# EAGLE design Pasqually_Pi_Hat (EAGLE 9.6.2)
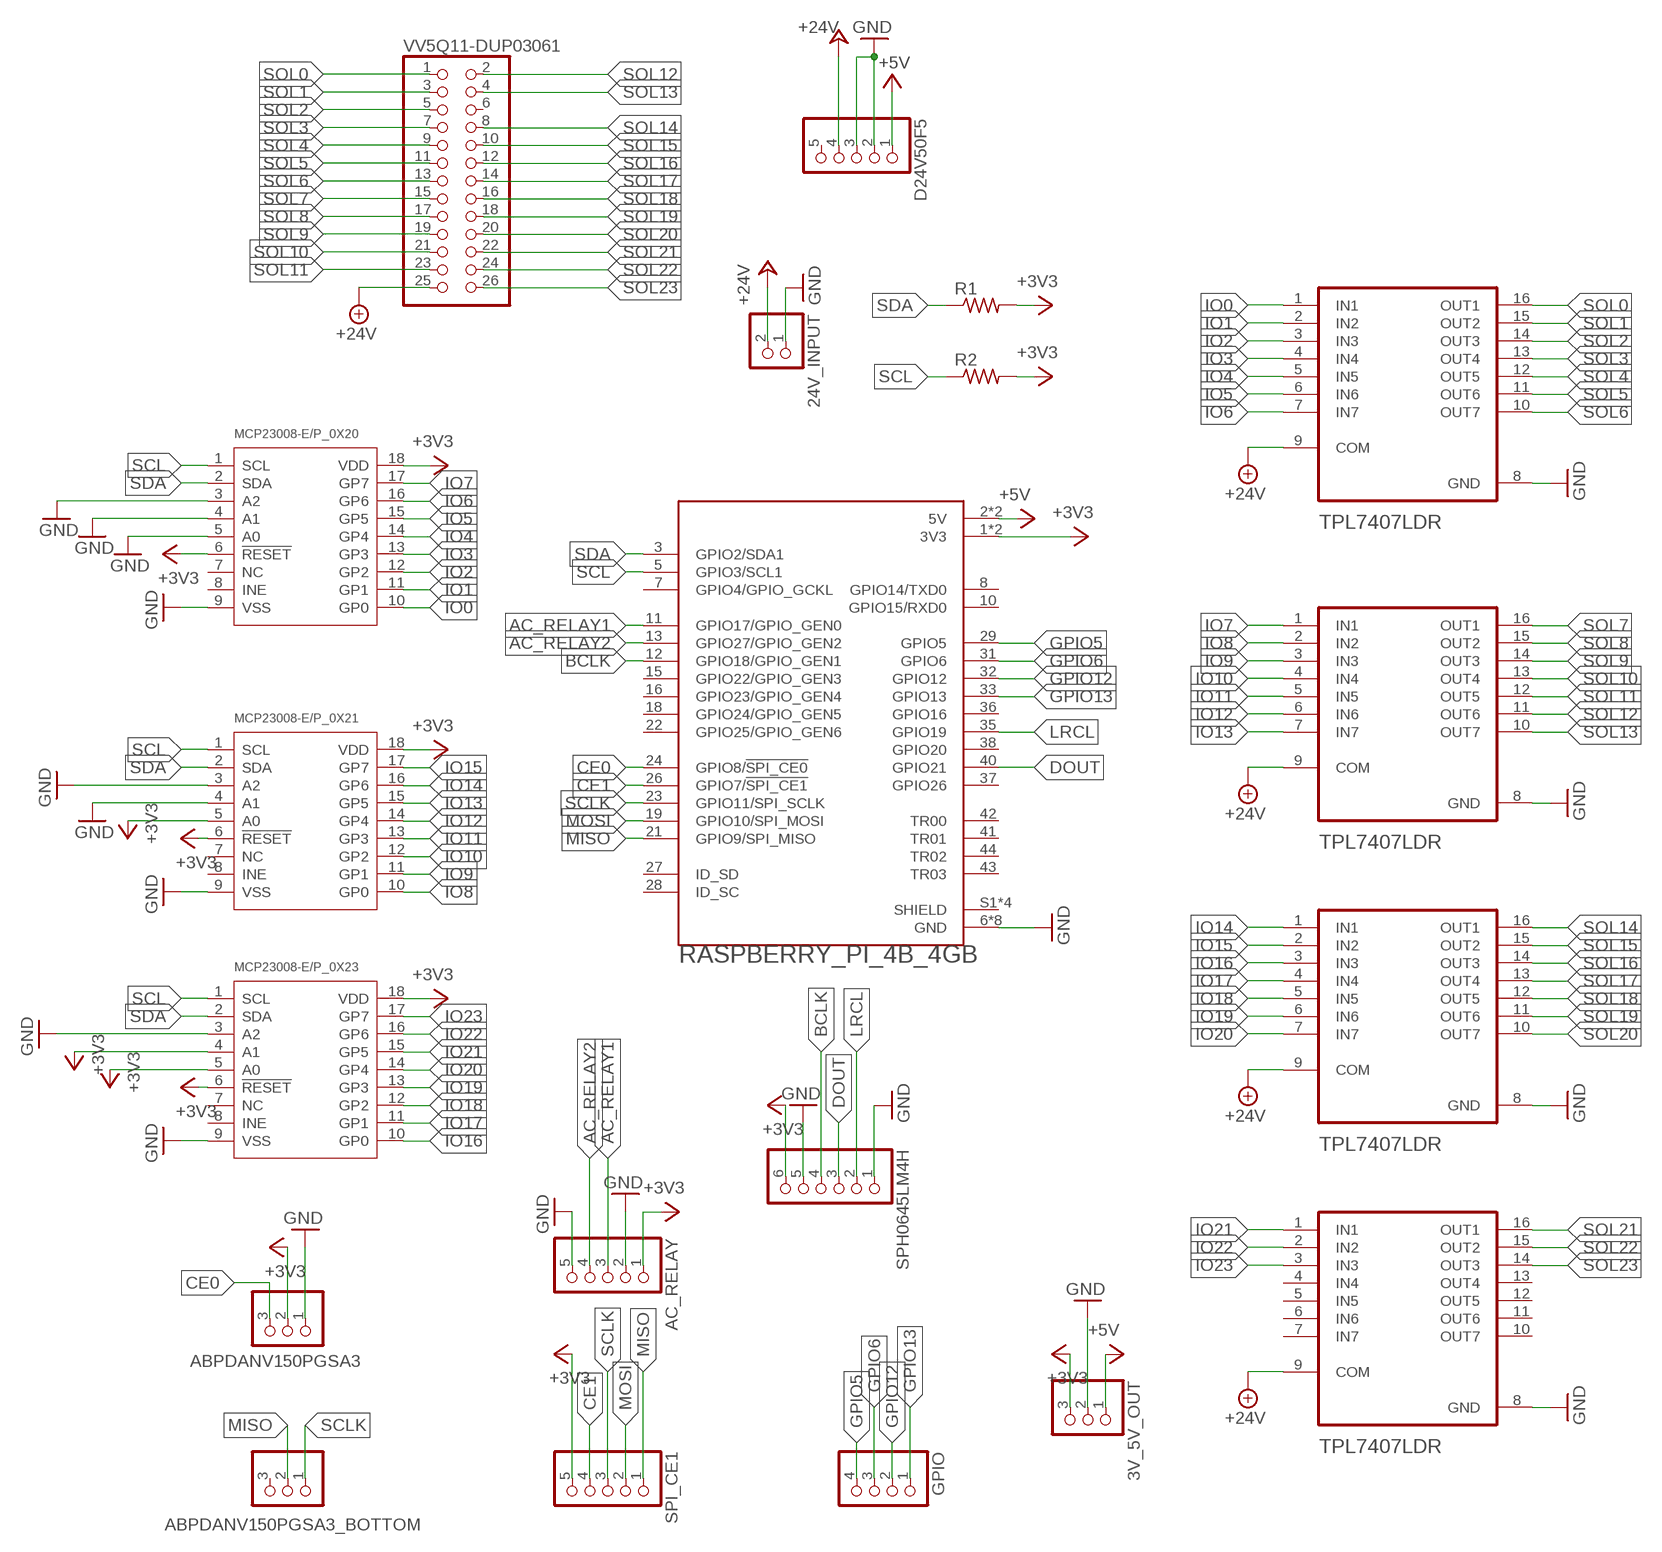
[diagram p0: schematic, sheet 1]

## Parts
3V_5V_OUT  PINHD-1X3  [1X03]
24V_INPUT  PINHD-1X2  [1X02]
ABPDANV150PGSA3  PINHD-1X3  [1X03]
ABPDANV150PGSA3_BOTTOM  PINHD-1X3  [1X03]
AC_RELAY  PINHD-1X5  [1X05]
D24V50F5  PINHD-1X5  [1X05]
GPIO  PINHD-1X4  [1X04]
MCP23008-E/P_0X20  INTERFACE-MCP23008-E/P(DIP18-7.62MM)  [DIP18-2.54-22.8X7.62MM]
MCP23008-E/P_0X21  INTERFACE-MCP23008-E/P(DIP18-7.62MM)  [DIP18-2.54-22.8X7.62MM]
MCP23008-E/P_0X23  INTERFACE-MCP23008-E/P(DIP18-7.62MM)  [DIP18-2.54-22.8X7.62MM]
R1  R-US_0309/10  [0309/10]
R2  R-US_0309/10  [0309/10]
SPH0645LM4H  PINHD-1X6  [1X06]
SPI_CE1  PINHD-1X5  [1X05]
U0  TPL7407LDR  [SOIC127P600X175-16N]
U1  TPL7407LDR  [SOIC127P600X175-16N]
U2  TPL7407LDR  [SOIC127P600X175-16N]
U3  TPL7407LDR  [SOIC127P600X175-16N]
U4  RASPBERRY_PI_4B_4GB  [MODULE_RASPBERRY_PI_4B_4GB]
VV5Q11-DUP03061  PINHD-2X13  [2X13]

## Nets
+3V3: 3V_5V_OUT.3 ABPDANV150PGSA3.2 AC_RELAY.1 MCP23008-E/P_0X20.6(!RESET) MCP23008-E/P_0X20.18(VDD) MCP23008-E/P_0X21.5(A0) MCP23008-E/P_0X21.6(!RESET) MCP23008-E/P_0X21.18(VDD) MCP23008-E/P_0X23.4(A1) MCP23008-E/P_0X23.5(A0) MCP23008-E/P_0X23.6(!RESET) MCP23008-E/P_0X23.18(VDD) R1.2 R2.2 SPH0645LM4H.6 SPI_CE1.5 U4.1(3V3) U4.17(3V3)
+5V: 3V_5V_OUT.1 D24V50F5.1 U4.2(5V) U4.4(5V)
+24V: 24V_INPUT.2 D24V50F5.4 U0.9(COM) U1.9(COM) U2.9(COM) U3.9(COM) VV5Q11-DUP03061.25
AC_RELAY1: AC_RELAY.3 U4.11(GPIO17/GPIO_GEN0)
AC_RELAY2: AC_RELAY.4 U4.13(GPIO27/GPIO_GEN2)
BCLK: SPH0645LM4H.4 U4.12(GPIO18/GPIO_GEN1)
CE0: ABPDANV150PGSA3.3 U4.24(GPIO8/!SPI_CE0!)
CE1: SPI_CE1.4 U4.26(GPIO7/!SPI_CE1!)
DOUT: SPH0645LM4H.3 U4.40(GPIO21)
GND: 3V_5V_OUT.2 24V_INPUT.1 ABPDANV150PGSA3.1 AC_RELAY.2 AC_RELAY.5 D24V50F5.2 D24V50F5.3 MCP23008-E/P_0X20.3(A2) MCP23008-E/P_0X20.4(A1) MCP23008-E/P_0X20.5(A0) MCP23008-E/P_0X20.9(VSS) MCP23008-E/P_0X21.3(A2) MCP23008-E/P_0X21.4(A1) MCP23008-E/P_0X21.9(VSS) MCP23008-E/P_0X23.3(A2) MCP23008-E/P_0X23.9(VSS) SPH0645LM4H.1 SPH0645LM4H.5 U0.8(GND) U1.8(GND) U2.8(GND) U3.8(GND) U4.6(GND) U4.9(GND) U4.14(GND) U4.20(GND) U4.25(GND) U4.30(GND) U4.34(GND) U4.39(GND)
GPIO5: GPIO.4 U4.29(GPIO5)
GPIO6: GPIO.3 U4.31(GPIO6)
GPIO12: GPIO.2 U4.32(GPIO12)
GPIO13: GPIO.1 U4.33(GPIO13)
IO0: MCP23008-E/P_0X20.10(GP0) U0.1(IN1)
IO1: MCP23008-E/P_0X20.11(GP1) U0.2(IN2)
IO2: MCP23008-E/P_0X20.12(GP2) U0.3(IN3)
IO3: MCP23008-E/P_0X20.13(GP3) U0.4(IN4)
IO4: MCP23008-E/P_0X20.14(GP4) U0.5(IN5)
IO5: MCP23008-E/P_0X20.15(GP5) U0.6(IN6)
IO6: MCP23008-E/P_0X20.16(GP6) U0.7(IN7)
IO7: MCP23008-E/P_0X20.17(GP7) U1.1(IN1)
IO8: MCP23008-E/P_0X21.10(GP0) U1.2(IN2)
IO9: MCP23008-E/P_0X21.11(GP1) U1.3(IN3)
IO10: MCP23008-E/P_0X21.12(GP2) U1.4(IN4)
IO11: MCP23008-E/P_0X21.13(GP3) U1.5(IN5)
IO12: MCP23008-E/P_0X21.14(GP4) U1.6(IN6)
IO13: MCP23008-E/P_0X21.15(GP5) U1.7(IN7)
IO14: MCP23008-E/P_0X21.16(GP6) U2.1(IN1)
IO15: MCP23008-E/P_0X21.17(GP7) U2.2(IN2)
IO16: MCP23008-E/P_0X23.10(GP0) U2.3(IN3)
IO17: MCP23008-E/P_0X23.11(GP1) U2.4(IN4)
IO18: MCP23008-E/P_0X23.12(GP2) U2.5(IN5)
IO19: MCP23008-E/P_0X23.13(GP3) U2.6(IN6)
IO20: MCP23008-E/P_0X23.14(GP4) U2.7(IN7)
IO21: MCP23008-E/P_0X23.15(GP5) U3.1(IN1)
IO22: MCP23008-E/P_0X23.16(GP6) U3.2(IN2)
IO23: MCP23008-E/P_0X23.17(GP7) U3.3(IN3)
LRCL: SPH0645LM4H.2 U4.35(GPIO19)
MISO: ABPDANV150PGSA3_BOTTOM.2 SPI_CE1.1 U4.21(GPIO9/SPI_MISO)
MOSI: SPI_CE1.2 U4.19(GPIO10/SPI_MOSI)
SCL: MCP23008-E/P_0X20.1(SCL) MCP23008-E/P_0X21.1(SCL) MCP23008-E/P_0X23.1(SCL) R2.1 U4.5(GPIO3/SCL1)
SCLK: ABPDANV150PGSA3_BOTTOM.1 SPI_CE1.3 U4.23(GPIO11/SPI_SCLK)
SDA: MCP23008-E/P_0X20.2(SDA) MCP23008-E/P_0X21.2(SDA) MCP23008-E/P_0X23.2(SDA) R1.1 U4.3(GPIO2/SDA1)
SOL0: U0.16(OUT1) VV5Q11-DUP03061.1
SOL1: U0.15(OUT2) VV5Q11-DUP03061.3
SOL2: U0.14(OUT3) VV5Q11-DUP03061.5
SOL3: U0.13(OUT4) VV5Q11-DUP03061.7
SOL4: U0.12(OUT5) VV5Q11-DUP03061.9
SOL5: U0.11(OUT6) VV5Q11-DUP03061.11
SOL6: U0.10(OUT7) VV5Q11-DUP03061.13
SOL7: U1.16(OUT1) VV5Q11-DUP03061.15
SOL8: U1.15(OUT2) VV5Q11-DUP03061.17
SOL9: U1.14(OUT3) VV5Q11-DUP03061.19
SOL10: U1.13(OUT4) VV5Q11-DUP03061.21
SOL11: U1.12(OUT5) VV5Q11-DUP03061.23
SOL12: U1.11(OUT6) VV5Q11-DUP03061.2
SOL13: U1.10(OUT7) VV5Q11-DUP03061.4
SOL14: U2.16(OUT1) VV5Q11-DUP03061.8
SOL15: U2.15(OUT2) VV5Q11-DUP03061.10
SOL16: U2.14(OUT3) VV5Q11-DUP03061.12
SOL17: U2.13(OUT4) VV5Q11-DUP03061.14
SOL18: U2.12(OUT5) VV5Q11-DUP03061.16
SOL19: U2.11(OUT6) VV5Q11-DUP03061.18
SOL20: U2.10(OUT7) VV5Q11-DUP03061.20
SOL21: U3.16(OUT1) VV5Q11-DUP03061.22
SOL22: U3.15(OUT2) VV5Q11-DUP03061.24
SOL23: U3.14(OUT3) VV5Q11-DUP03061.26
Unconnected: ABPDANV150PGSA3_BOTTOM.3 D24V50F5.5 MCP23008-E/P_0X20.7(NC) MCP23008-E/P_0X20.8(INE) MCP23008-E/P_0X21.7(NC) MCP23008-E/P_0X21.8(INE) MCP23008-E/P_0X23.7(NC) MCP23008-E/P_0X23.8(INE) U3.4(IN4) U3.5(IN5) U3.6(IN6) U3.7(IN7) U3.10(OUT7) U3.11(OUT6) U3.12(OUT5) U3.13(OUT4) U4.7(GPIO4/GPIO_GCKL) U4.8(GPIO14/TXD0) U4.10(GPIO15/RXD0) U4.15(GPIO22/GPIO_GEN3) U4.16(GPIO23/GPIO_GEN4) U4.18(GPIO24/GPIO_GEN5) U4.22(GPIO25/GPIO_GEN6) U4.27(ID_SD) U4.28(ID_SC) U4.36(GPIO16) U4.37(GPIO26) U4.38(GPIO20) U4.41(TR01) U4.42(TR00) U4.43(TR03) U4.44(TR02) VV5Q11-DUP03061.6

## Power pins joined to a net without a drawn wire
SHIELD: U4.S1(SHIELD) U4.S2(SHIELD) U4.S3(SHIELD) U4.S4(SHIELD)

## Library data of the parts
3V_5V_OUT ABPDANV150PGSA3 ABPDANV150PGSA3_BOTTOM = pinhead:PINHD-1X3: PIN HEADER
24V_INPUT = pinhead:PINHD-1X2: PIN HEADER
AC_RELAY D24V50F5 SPI_CE1 = pinhead:PINHD-1X5: PIN HEADER
GPIO = pinhead:PINHD-1X4: PIN HEADER
MCP23008-E/P_0X20 MCP23008-E/P_0X21 MCP23008-E/P_0X23 = INTERFACE-MCP23008-E_P_DIP18-7.62MM_:INTERFACE-MCP23008-E/P(DIP18-7.62MM): 310070051 Check availability <https://pricing.snapeda.com/parts/MCP23008-E/P/Microchip/view-part?ref=eda>; AVAILABILITY: In Stock; CHECK_PRICES: https://www.snapeda.com/parts/MCP23008-E/P/Microchip/view-part/?ref=eda; DESCRIPTION: 8-BIT INPUT/OUTPUT EXPANDER, I2C INTERFACE | Microchip Technology Inc. MCP23008-E/P; MF: Microchip; MP: MCP23008-E/P; PACKAGE: PDIP-18 Microchip; PRICE: None; SNAPEDA_LINK: https://www.snapeda.com/parts/MCP23008-E/P/Microchip/view-part/?ref=snap
R1 R2 = rcl:R-US_: RESISTOR, American symbol; SPICEPREFIX: R
SPH0645LM4H = pinhead:PINHD-1X6: PIN HEADER
U0 U1-U3 = TPL7407LDR:TPL7407LDR: Check availability <https://pricing.snapeda.com/parts/TPL7407LDR/Texas%20Instruments/view-part?ref=eda>; AVAILABILITY: In Stock; CHECK_PRICES: https://www.snapeda.com/parts/TPL7407LDR/Texas+Instruments/view-part/?ref=eda; DESCRIPTION: 40-V, 7-ch NMOS array low-side driver; MF: Texas Instruments; MP: TPL7407LDR; PACKAGE: SOIC-16 Texas Instruments; PRICE: None; PURCHASE-URL: https://www.snapeda.com/api/url_track_click_mouser/?unipart_id=48350&manufacturer=Texas Instruments&part_name=TPL7407LDR&search_term=None; SNAPEDA_LINK: https://www.snapeda.com/parts/TPL7407LDR/Texas+Instruments/view-part/?ref=snap
U4 = RASPBERRY_PI_4B_4GB:RASPBERRY_PI_4B_4GB: Check availability <https://pricing.snapeda.com/parts/RASPBERRY%20PI%204B/4GB/Raspberry%20Pi/view-part?ref=eda>; AVAILABILITY: In Stock; CHECK_PRICES: https://www.snapeda.com/parts/RASPBERRY%20PI%204B/4GB/Raspberry+Pi/view-part/?ref=eda; DESCRIPTION: BCM2711 Raspberry Pi 4 Model B 4GB - ARM® Cortex®-A72 MPU Embedded Evaluation Board; MF: Raspberry Pi; MP: RASPBERRY PI 4B/4GB; PACKAGE: None; PRICE: None; SNAPEDA_LINK: https://www.snapeda.com/parts/RASPBERRY%20PI%204B/4GB/Raspberry+Pi/view-part/?ref=snap
VV5Q11-DUP03061 = pinhead:PINHD-2X13: PIN HEADER

## Board
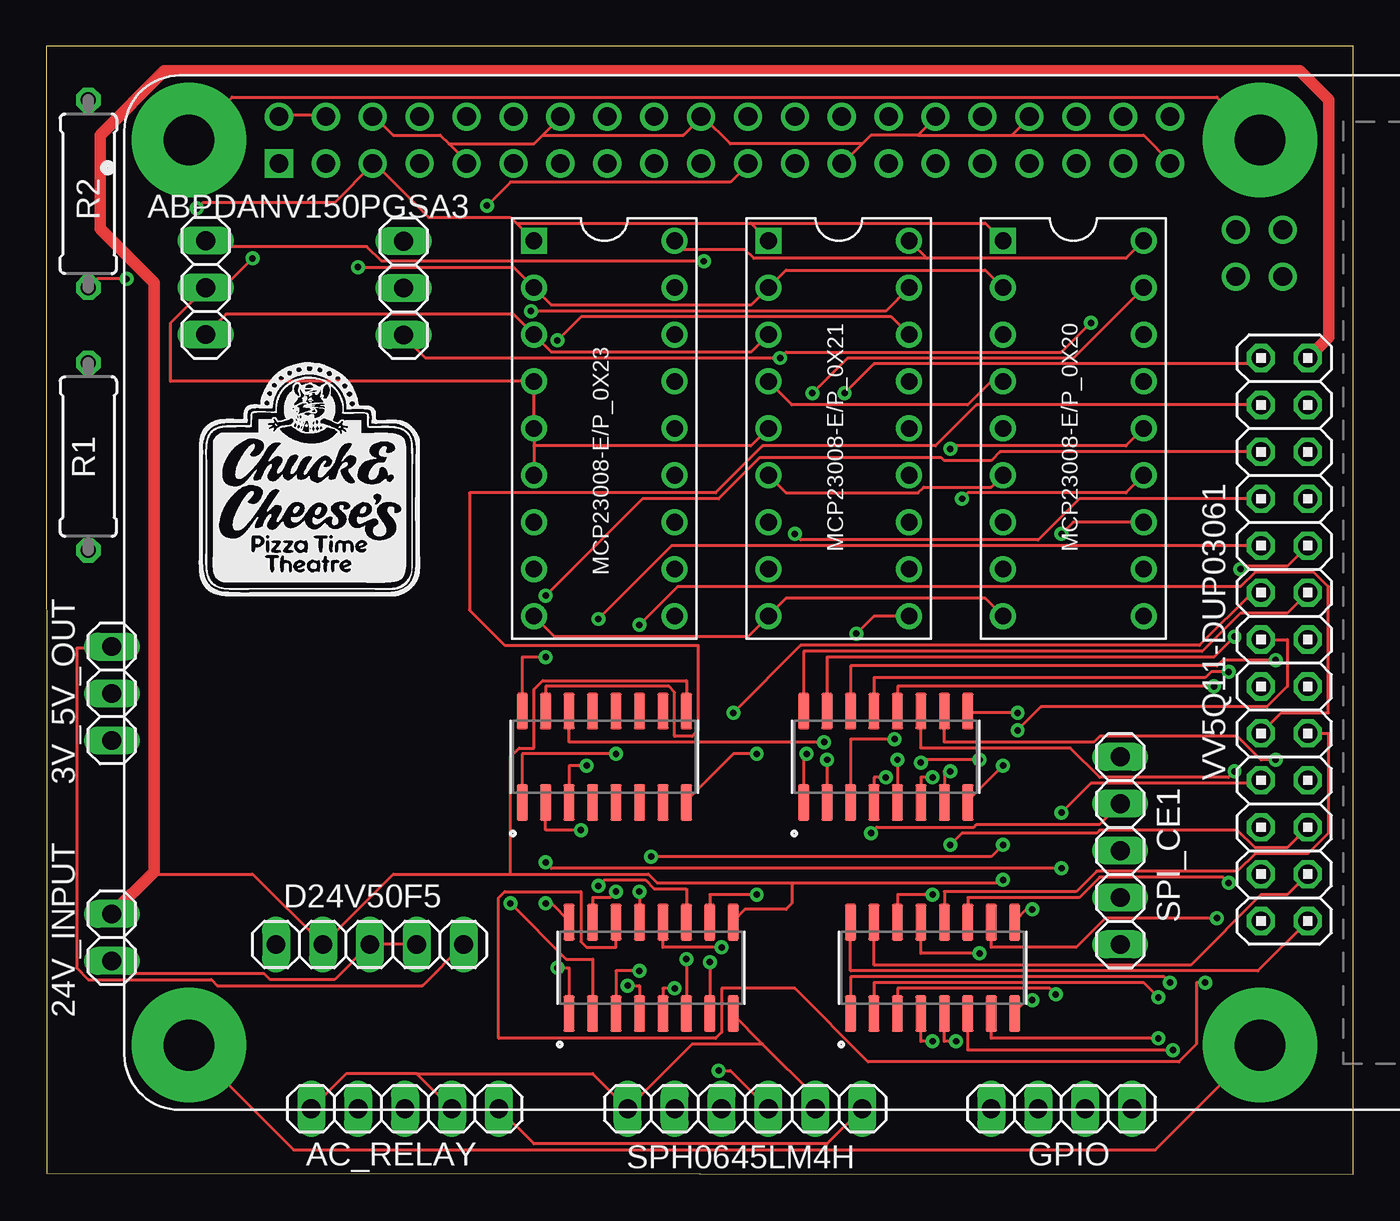
[diagram p1: board, top side]
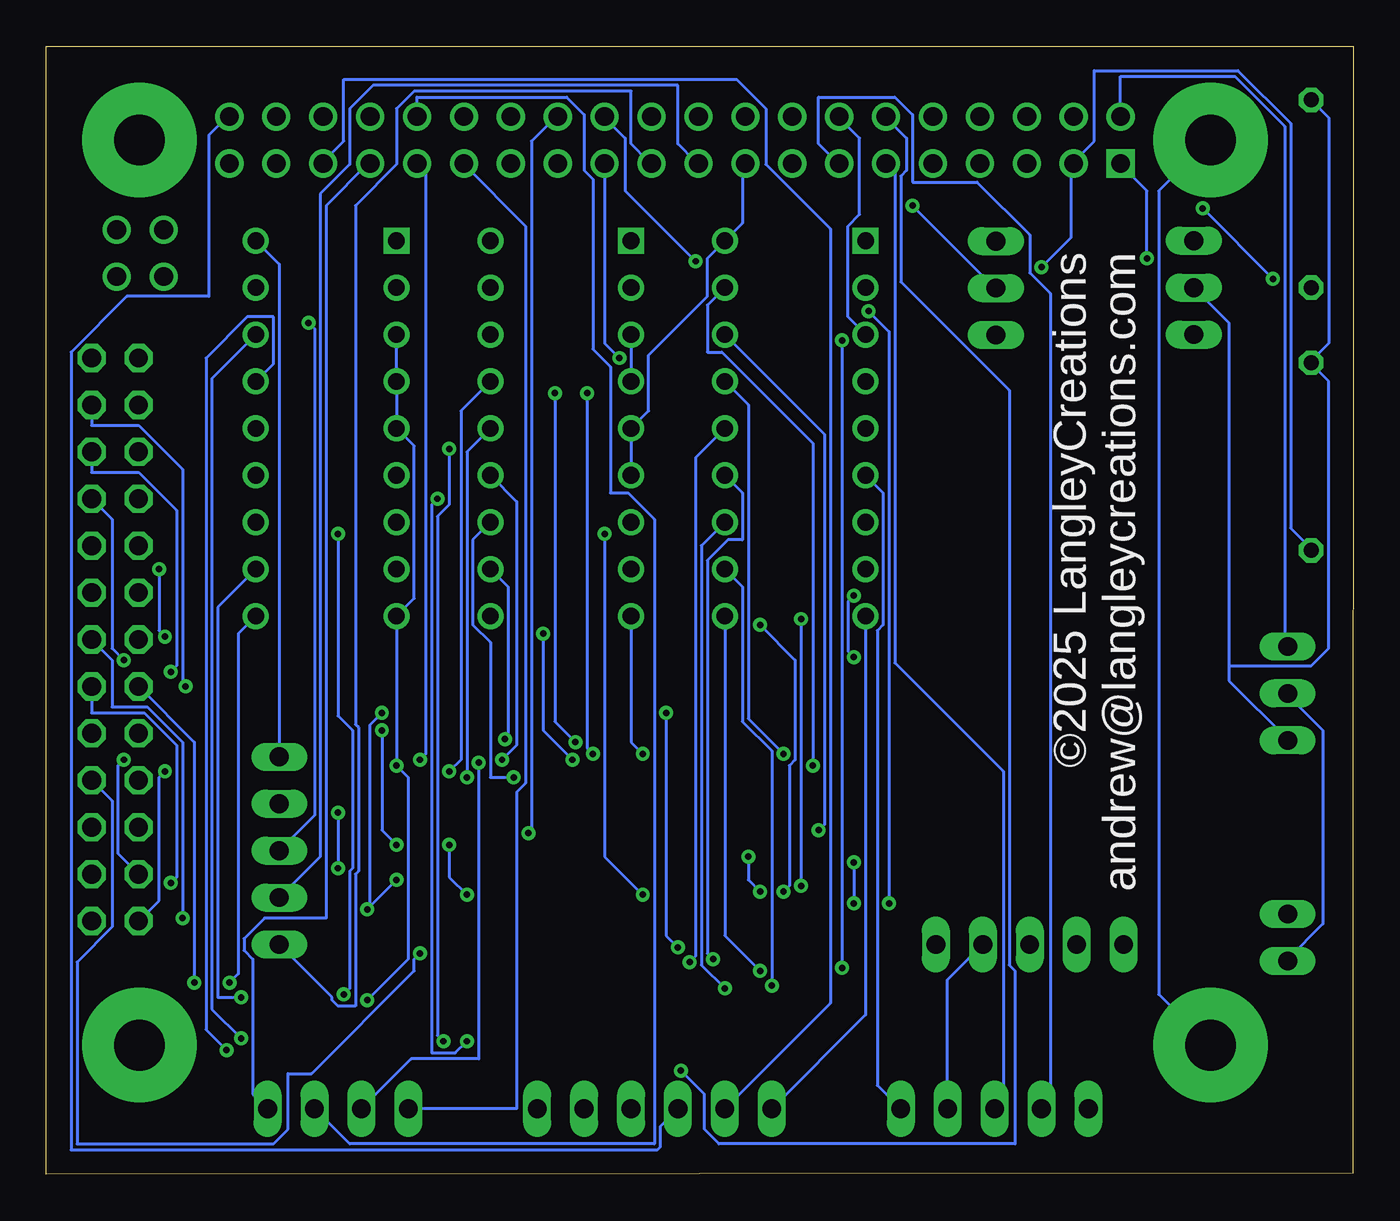
[diagram p2: board, bottom side, seen from below]

Size 70.79 x 61.08 mm. Coordinates in mm from the lower left corner, seen from the top.
Outline: 0.04,0.06 70.79,0 70.79,61.08 0,61.08 0.04,0.06
Copper layers (1*16): Top 0.035mm / dielectric 1.5mm / Bottom 0.035mm
Design rules "default": minimum track width 6mil, minimum drill 0.35mm, track to track 6mil, track to pad 6mil, pad to pad 6mil, via to via 6mil, smd to smd 6mil, copper to edge 40mil, drill to drill 6mil, minimum pad ring 10mil, minimum via ring 8mil, stop-mask expansion 4mil, vias tented up to drill 0mil, thermal gap 10mil

### Footprints (pad centres in the part's own frame; a part is rotated, then mirrored left to right if it is on the bottom)
1X03 = drill 1.016 long: 1 -2.54,0; 2 0,0; 3 2.54,0
1X02 = drill 1.016 long: 1 -1.27,0; 2 1.27,0
1X05 = drill 1.016 long: 1 -5.08,0; 2 -2.54,0; 3 0,0; 4 2.54,0; 5 5.08,0
1X04 = drill 1.016 long: 1 -3.81,0; 2 -1.27,0; 3 1.27,0; 4 3.81,0
DIP18-2.54-22.8X7.62MM = drill 0.9 pad 1.4 square: 1 -10.16,-3.81 | drill 0.9 pad 1.4: 2 -7.62,-3.81; 3 -5.08,-3.81; 4 -2.54,-3.81; 5 0,-3.81; 6 2.54,-3.81; 7 5.08,-3.81; 8 7.62,-3.81; 9 10.16,-3.81; 10 10.16,3.81; 11 7.62,3.81; 12 5.08,3.81; 13 2.54,3.81; 14 0,3.81; 15 -2.54,3.81; 16 -5.08,3.81; 17 -7.62,3.81; 18 -10.16,3.81
0309/10 = drill 0.813 octagon: 1 -5.08,0; 2 5.08,0
1X06 = drill 1.016 long: 1 -6.35,0; 2 -3.81,0; 3 -1.27,0; 4 1.27,0; 5 3.81,0; 6 6.35,0
SOIC127P600X175-16N = smd 1.97 x 0.6: 1 -2.475,4.445; 2 -2.475,3.175; 3 -2.475,1.905; 4 -2.475,0.635; 5 -2.475,-0.635; 6 -2.475,-1.905; 7 -2.475,-3.175; 8 -2.475,-4.445; 9 2.475,-4.445; 10 2.475,-3.175; 11 2.475,-1.905; 12 2.475,-0.635; 13 2.475,0.635; 14 2.475,1.905; 15 2.475,3.175; 16 2.475,4.445
MODULE_RASPBERRY_PI_4B_4GB = drill 1.016 square: 1 -34.13,23.23 | drill 1.016: 2 -34.13,25.77; 3 -31.59,23.23; 4 -31.59,25.77; 5 -29.05,23.23; 6 -29.05,25.77; 7 -26.51,23.23; 8 -26.51,25.77; 9 -23.97,23.23; 10 -23.97,25.77; 11 -21.43,23.23; 12 -21.43,25.77; 13 -18.89,23.23; 14 -18.89,25.77; 15 -16.35,23.23; 16 -16.35,25.77; 17 -13.81,23.23; 18 -13.81,25.77; 19 -11.27,23.23; 20 -11.27,25.77; 21 -8.73,23.23; 22 -8.73,25.77; 23 -6.19,23.23; 24 -6.19,25.77; 25 -3.65,23.23; 26 -3.65,25.77; 27 -1.11,23.23; 28 -1.11,25.77; 29 1.43,23.23; 30 1.43,25.77; 31 3.97,23.23; 32 3.97,25.77; 33 6.51,23.23; 34 6.51,25.77; 35 9.05,23.23; 36 9.05,25.77; 37 11.59,23.23; 38 11.59,25.77; 39 14.13,23.23; 40 14.13,25.77; 41 20.23,17.107; 42 20.23,19.647; 43 17.69,17.107; 44 17.69,19.647 | drill 2.75 pad 6.2: S1 -39,24.5; S2 19,24.5; S3 19,-24.5; S4 -39,-24.5
2X13 = drill 1.016 octagon: 1 -15.24,-1.27; 2 -15.24,1.27; 3 -12.7,-1.27; 4 -12.7,1.27; 5 -10.16,-1.27; 6 -10.16,1.27; 7 -7.62,-1.27; 8 -7.62,1.27; 9 -5.08,-1.27; 10 -5.08,1.27; 11 -2.54,-1.27; 12 -2.54,1.27; 13 0,-1.27; 14 0,1.27; 15 2.54,-1.27; 16 2.54,1.27; 17 5.08,-1.27; 18 5.08,1.27; 19 7.62,-1.27; 20 7.62,1.27; 21 10.16,-1.27; 22 10.16,1.27; 23 12.7,-1.27; 24 12.7,1.27; 25 15.24,-1.27; 26 15.24,1.27

### Placement (x,y rotation side)
3V_5V_OUT  3.56,26.03 270 top
24V_INPUT  3.56,12.83 90 top
ABPDANV150PGSA3  8.64,48.01 90 top
ABPDANV150PGSA3_BOTTOM  19.36,47.98 90 top
AC_RELAY  19.43,3.56 180 top
D24V50F5  17.53,12.45 180 top
GPIO  54.99,3.56 180 top
MCP23008-E/P_0X20  55.63,40.39 270 top
MCP23008-E/P_0X21  42.93,40.39 270 top
MCP23008-E/P_0X23  30.23,40.39 270 top
R1  2.29,38.86 90 top
R2  2.29,53.09 90 top
SPH0645LM4H  37.85,3.56 0 top
SPI_CE1  58.17,17.53 90 top
U0  48.01,11.18 90 top
U1  45.47,22.61 90 top
U2  32.77,11.18 90 top
U3  30.23,22.61 90 top
U4  46.74,31.5 0 top
VV5Q11-DUP03061  67.06,28.96 90 top

### Tracks (layer width: path | path; a pad name or v marks a point on that pad's centre or on a via)
+3V3  (via drill 0.35)
  Top 0.152: 47.69,49.59 MCP23008-E/P_0X21.18 | 47.69,49.59 58.48,49.59 MCP23008-E/P_0X20.18 | MCP23008-E/P_0X23.18 34.51,50.07 37.85,50.07 38.32,49.59 47.69,49.59 | v11.18,49.59 9.59,48.01 ABPDANV150PGSA3.2 6.73,46.1 6.73,42.93 MCP23008-E/P_0X23.4 MCP23008-E/P_0X23.5 26.42,39.43 | AC_RELAY.1 26.42,1.65 42.29,1.65 SPH0645LM4H.6 | 26.42,39.43 MCP23008-E/P_0X23.6 | MCP23008-E/P_0X20.6 51.18,37.21 47.53,37.21 47.21,36.89 40.07,36.89 MCP23008-E/P_0X21.6 | 26.42,39.43 38.16,39.43 MCP23008-E/P_0X21.5
  Bottom 0.152: U4.17 33.08,54.67 33.08,51.5 MCP23008-E/P_0X23.18 34.99,49.59 34.99,47.53 38.16,44.35 38.16,41.34 MCP23008-E/P_0X21.5 MCP23008-E/P_0X21.6 | SPI_CE1.5 58.17,49.28 MCP23008-E/P_0X20.18 | R2.2 1.33,57.21 1.33,44.99 2.29,44.04 R1.2 2.29,43.88 1.33,42.93 1.33,28.48 2.29,27.53 6.73,27.53 | 6.73,27.53 6.73,46.1 ABPDANV150PGSA3.2 | 6.73,27.53 6.73,26.73 3.56,23.56 3V_5V_OUT.3 | v11.18,49.59 11.18,53.24 12.61,54.67 U4.1 | AC_RELAY.1 25.78,4.83 25.78,29.43 25.46,29.75 25.46,36.89 MCP23008-E/P_0X23.6
+5V
  Top 0.152: U4.4 15.14,57.37 12.76,57.37 U4.2 | D24V50F5.1 20.38,10.22 9.27,10.22 8.95,10.54 2.29,10.54 1.65,11.18 1.65,28.48 3.56,28.48 3V_5V_OUT.1
  Bottom 0.152: 3V_5V_OUT.1 3.56,28.64 3.71,28.8 3.71,56.74 6.41,59.44 12.61,59.44 12.61,57.37 U4.2
+24V  (via drill 0.35)
  Top 0.152: 40.39,15.78 40.39,14.67 40.07,14.35 37.85,14.35 37.21,13.72 U2.9 | 40.39,15.78 33.08,15.78 32.61,16.26 25.15,16.26 | 25.15,16.26 18.8,16.26 D24V50F5.4 11.18,16.26 6.1,16.26 5.84,16.38 | U3.9 34.67,26.73 26.89,26.73 26.42,26.26 26.42,23.08 25.62,23.08 25.15,22.61 25.15,16.26 | v53.4,14.35 53.09,14.35 52.45,13.72 U0.9 | v51.82,15.94 51.66,15.78 40.39,15.78 | v52.61,24.99 49.91,24.99 U1.9
  Top 0.635: 24V_INPUT.2 5.84,16.38 5.84,48.26 2.92,51.18 2.92,56.26 6.4,59.74 67.88,59.74 69.46,58.17 69.46,45.33 VV5Q11-DUP03061.25
  Bottom 0.152: v51.82,15.94 53.25,14.51 | v52.61,24.99 53.25,24.35 53.25,14.51 | 53.25,14.51 v53.4,14.35
AC_RELAY1
  Bottom 0.152: AC_RELAY.3 18.96,4.03 18.96,21.81 24.83,27.69 24.83,54.2 25.3,54.67 U4.11
AC_RELAY2
  Bottom 0.152: AC_RELAY.4 16.41,4.03 16.41,47.69 17.53,48.8 17.53,50.86 20.38,53.72 23.88,53.72 23.88,57.37 24.83,58.33 28.96,58.33 28.96,55.78 28,54.83 U4.13
BCLK  (via drill 0.35)
  Top 0.152: SPH0645LM4H.4 37.05,5.62 v36.42,5.62
  Bottom 0.152: v36.42,5.62 35.15,4.35 35.15,2.45 34.35,1.65 18.32,1.65 18.32,11.02 18.64,11.33 18.64,42.45 24.51,48.32 24.51,54.04 24.19,54.36 24.19,56.1 25.3,57.21 U4.12
CE0  (via drill 0.35)
  Top 0.152: ABPDANV150PGSA3.3 8.95,50.23 17.37,50.23 18.16,49.43 v35.62,49.43
  Bottom 0.152: v35.62,49.43 39.43,53.24 39.43,56.1 40.55,57.21 U4.24
CE1  (via drill 0.35)
  Top 0.152: SPI_CE1.4 57.06,18.95 50.39,18.95 50.23,18.8 44.99,18.8 v44.67,18.48
  Bottom 0.152: v44.67,18.48 44.51,18.64 44.51,55.94 43.24,57.21 U4.26
DOUT
  Bottom 0.152: SPH0645LM4H.3 37.53,2.6 37.53,1.49 37.69,1.33 69.44,1.33 69.44,44.51 66.42,47.53 61.98,47.53 61.98,56.26 61.02,57.21 U4.40
GND  (via drill 0.35)
  Top 0.152: 38.8,7.05 41.66,4.19 SPH0645LM4H.5 | 38.8,7.05 37.21,8.64 U2.8 | 38.8,7.05 34.99,7.05 SPH0645LM4H.1 29.59,5.46 20.07,5.46 | D24V50F5.2 D24V50F5.3 15.62,10.54 12.13,10.54 11.81,10.86 4.19,10.86 3.56,11.49 24V_INPUT.1 | AC_RELAY.5 16.26,5.46 20.07,5.46 | AC_RELAY.2 20.07,5.46 | 21.81,55.78 21.34,56.26 18.8,56.26 17.84,57.21 U4.6 | 21.81,55.78 22.77,54.83 U4.9 | 26.89,56.26 26.42,55.78 21.81,55.78 | 26.89,56.26 27.85,57.21 U4.14 | 26.89,56.26 34.51,56.26 35.47,57.21 U4.20 35.62,57.21 37.05,55.78 44.2,55.78 | 44.2,55.78 44.67,56.26 47.21,56.26 | 44.2,55.78 43.24,54.83 U4.25 | 47.21,56.26 48.17,57.21 U4.30 | 52.29,56.26 53.25,57.21 U4.34 | 47.21,56.26 52.29,56.26 | 52.29,56.26 59.44,56.26 60.86,54.83 U4.39 | MCP23008-E/P_0X21.3 38.16,44.51 27.37,44.51 MCP23008-E/P_0X23.3 25.3,46.58 9.75,46.58 ABPDANV150PGSA3.1 | v38.48,22.77 37.21,22.77 34.67,20.23 U3.8 | MCP23008-E/P_0X23.9 27.53,29.12 38,29.12 MCP23008-E/P_0X21.9 40.07,31.18 50.86,31.18 MCP23008-E/P_0X20.9 | v51.82,22.13 49.91,20.23 U1.8 | v53.4,9.43 53.09,9.43 52.45,8.79 U0.8 | MCP23008-E/P_0X21.4 40.39,41.66 49.91,41.66 51.18,42.93 MCP23008-E/P_0X20.4
  Bottom 0.152: 24V_INPUT.1 3.56,11.65 1.65,13.56 1.65,24.03 3.56,25.94 3V_5V_OUT.2 | D24V50F5.2 21.97,10.54 AC_RELAY.2 | MCP23008-E/P_0X21.3 MCP23008-E/P_0X21.4 | v38.48,22.77 39.12,23.4 MCP23008-E/P_0X21.9 | MCP23008-E/P_0X20.3 MCP23008-E/P_0X20.4 MCP23008-E/P_0X20.5 50.86,39.43 50.86,31.18 MCP23008-E/P_0X20.9 v51.82,22.13 51.18,21.49 51.18,11.65 v53.4,9.43 | MCP23008-E/P_0X23.3 27.37,46.42 27.37,51.34 26.73,51.98 26.73,56.1 27.85,57.21 U4.14 | SPH0645LM4H.1 26.42,8.64 MCP23008-E/P_0X23.9
GPIO5
  Bottom 0.152: GPIO.4 45.31,3.56 45.31,20.7 44.83,21.18 44.83,51.34 48.17,54.67 U4.29
GPIO6  (via drill 0.35)
  Top 0.152: v47.37,22.29 47.53,22.45 v50.55,22.45
  Bottom 0.152: GPIO.3 51.02,6.26 47.37,6.26 v47.37,22.29 | v50.55,22.45 50.23,22.77 50.23,54.2 50.7,54.67 U4.31
GPIO12
  Bottom 0.152: GPIO.2 54.36,1.65 37.85,1.65 37.85,35.46 39.28,36.89 40.23,36.89 40.23,43.72 41.18,44.67 41.18,53.88 41.66,54.36 41.66,57.37 42.61,58.33 50.7,58.33 50.7,57.37 U4.32
GPIO13
  Bottom 0.152: GPIO.1 59.59,4.35 59.59,11.65 60.07,12.13 60.07,12.76 58.96,13.88 55.63,13.88 55.63,52.45 53.4,54.67 U4.33
IO0  (via drill 0.35)
  Top 0.152: U0.1 43.56,10.7 60.55,10.7 v60.86,10.38
  Bottom 0.152: v60.86,10.38 60.39,10.86 60.39,29.27 MCP23008-E/P_0X20.10
IO1  (via drill 0.35)
  Top 0.152: U0.2 44.83,10.38 59.44,10.38 v60.23,9.59
  Bottom 0.152: v60.23,9.59 61.5,9.59 61.5,30.7 MCP23008-E/P_0X20.11
IO2  (via drill 0.35)
  Top 0.152: U0.3 46.1,10.06 54.36,10.06 v54.67,9.75 | v54.99,34.67 55.63,35.31 MCP23008-E/P_0X20.12
  Bottom 0.152: v54.67,9.75 54.36,10.06 54.36,16.41 54.2,16.57 54.2,24.03 54.99,24.83 v54.99,34.67
IO3  (via drill 0.35)
  Top 0.152: U0.4 47.37,7.21 v48.01,7.21 | v49.59,36.58 49.91,36.89 58.48,36.89 MCP23008-E/P_0X20.13
  Bottom 0.152: v48.01,7.21 48.64,6.57 49.91,6.57 49.91,36.26 v49.59,36.58
IO4  (via drill 0.35)
  Top 0.152: U0.5 48.64,7.21 v49.28,7.21 | v48.96,39.27 49.12,39.43 58.48,39.43 MCP23008-E/P_0X20.14
  Bottom 0.152: v49.28,7.21 49.59,7.53 49.59,35.62 48.96,36.26 v48.96,39.27
IO5  (via drill 0.35)
  Top 0.152: U0.6 49.91,6.73 v61.02,6.73
  Bottom 0.152: v61.02,6.73 62.13,7.84 62.13,44.2 59.91,46.42 58.48,46.42 58.48,43.88 MCP23008-E/P_0X20.15
IO6  (via drill 0.35)
  Top 0.152: U0.7 51.18,7.37 v60.23,7.37
  Bottom 0.152: v60.23,7.37 61.82,8.95 61.82,43.09 MCP23008-E/P_0X20.16
IO7  (via drill 0.35)
  Top 0.152: U1.1 41.02,22.77 v41.18,22.77 | v41.5,42.29 43.4,44.2 55.63,44.2 MCP23008-E/P_0X20.17
  Bottom 0.152: v41.18,22.77 41.5,23.08 v41.5,42.29
IO8  (via drill 0.35)
  Top 0.152: v42.29,22.45 U1.2 | v43.88,29.27 44.83,30.23 MCP23008-E/P_0X21.10
  Bottom 0.152: v42.29,22.45 43.88,24.03 v43.88,29.27
IO9  (via drill 0.35)
  Top 0.152: U1.3 43.56,23.56 v45.94,23.56
  Bottom 0.152: v45.94,23.56 45.78,23.72 45.78,31.81 MCP23008-E/P_0X21.11
IO10  (via drill 0.35)
  Top 0.152: U1.4 44.83,21.49 v45.47,21.49
  Bottom 0.152: v45.47,21.49 46.74,21.49 46.74,28.8 47.69,29.75 47.69,34.35 MCP23008-E/P_0X21.12
IO11  (via drill 0.35)
  Top 0.152: v46.1,22.45 U1.5
  Bottom 0.152: v46.1,22.45 45.31,23.24 45.31,36.42 MCP23008-E/P_0X21.13
IO12  (via drill 0.35)
  Top 0.152: U1.6 47.37,21.49 v48.01,21.49
  Bottom 0.152: v48.01,21.49 48.01,39.12 MCP23008-E/P_0X21.14
IO13  (via drill 0.35)
  Top 0.152: U1.7 48.64,21.81 v48.96,21.81
  Bottom 0.152: v48.96,21.81 48.32,22.45 48.32,41.34 MCP23008-E/P_0X21.15
IO14  (via drill 0.35)
  Top 0.152: U2.1 28.32,11.18 v27.69,11.18 | v27.69,45.15 28.96,46.42 45.78,46.42 MCP23008-E/P_0X21.16
  Bottom 0.152: v27.69,45.15 v27.69,11.18
IO15  (via drill 0.35)
  Top 0.152: U2.2 29.59,11.65 28.16,11.65 v25.15,14.67 | v26.26,46.74 45.47,46.74 MCP23008-E/P_0X21.17
  Bottom 0.152: v25.15,14.67 25.15,45.62 v26.26,46.74
IO16  (via drill 0.35)
  Top 0.152: U2.3 30.86,11.02 v32.13,11.02
  Bottom 0.152: v32.13,11.02 34.04,12.92 MCP23008-E/P_0X23.10
IO17  (via drill 0.35)
  Top 0.152: U2.4 32.13,10.22 v31.5,10.22
  Bottom 0.152: v31.5,10.22 31.5,22.92 33.08,24.51 33.08,31.81 MCP23008-E/P_0X23.11
IO18  (via drill 0.35)
  Top 0.152: U2.5 33.4,10.06 v34.04,10.06
  Bottom 0.152: v34.04,10.06 35.31,11.33 35.31,34.04 MCP23008-E/P_0X23.12
IO19  (via drill 0.35)
  Top 0.152: v34.67,11.65 U2.6
  Bottom 0.152: v34.67,11.65 34.99,11.97 34.99,33.24 33.88,34.35 33.08,34.35 33.08,36.89 MCP23008-E/P_0X23.13
IO20  (via drill 0.35)
  Top 0.152: v35.94,11.49 U2.7
  Bottom 0.152: v35.94,11.49 35.62,11.81 35.62,38.8 MCP23008-E/P_0X23.14
IO21  (via drill 0.35)
  Top 0.152: U3.1 25.78,22.77 v30.86,22.77
  Bottom 0.152: v30.86,22.77 32.77,24.67 32.77,41.66 MCP23008-E/P_0X23.15
IO22  (via drill 0.35)
  Top 0.152: U3.2 27.05,18.64 v28.96,18.64
  Bottom 0.152: v28.96,18.64 28.64,18.95 28.64,40.07 MCP23008-E/P_0X23.16
IO23  (via drill 0.35)
  Top 0.152: U3.3 28.32,22.13 v29.27,22.13
  Bottom 0.152: v29.27,22.13 29.27,39.59 34.2,44.51 34.99,44.51 34.99,47.05 MCP23008-E/P_0X23.17
LRCL
  Bottom 0.152: SPH0645LM4H.2 28.32,9.27 28.32,51.18 31.81,54.67 31.81,57.69 33.4,59.28 54.67,59.28 54.67,55.94 55.78,54.83 U4.35
MISO  (via drill 0.35)
  Top 0.152: v23.88,52.45 25.15,53.72 37.05,53.72 38,54.67 U4.21
  Bottom 0.152: v23.88,52.45 19.43,48.01 ABPDANV150PGSA3_BOTTOM.2 | SPI_CE1.1 55.31,9.59 55.31,9.43 54.99,9.11 54.04,9.11 54.04,16.26 53.88,16.41 53.88,24.19 54.04,24.35 54.04,52.45 51.82,54.67 51.82,57.69 50.86,58.64 39.12,58.64 39.12,55.78 38.16,54.83 U4.21
MOSI
  Bottom 0.152: SPI_CE1.2 55.94,17.21 55.94,53.09 54.36,54.67 54.36,57.69 53.09,58.96 36.58,58.96 36.58,55.78 35.62,54.83 U4.19
SCL  (via drill 0.35)
  Top 0.152: R2.1 2.76,48.48 v4.35,48.48 | v8.16,52.29 8.48,52.61 15.62,52.61 17.68,54.67 U4.5 17.84,54.67 20.7,51.82 25.15,51.82 25.46,51.5 | 25.46,51.5 MCP23008-E/P_0X23.1 | 38.16,51.5 MCP23008-E/P_0X21.1 | 25.46,51.5 38.16,51.5 | MCP23008-E/P_0X20.1 50.86,51.5 38.16,51.5
  Bottom 0.152: v8.16,52.29 v4.35,48.48
SCLK  (via drill 0.35)
  Top 0.152: ABPDANV150PGSA3_BOTTOM.1 19.43,45.31 20.54,44.2 v39.75,44.2 40.07,44.51 54.99,44.51 v56.58,46.1
  Bottom 0.152: v39.75,44.2 40.55,44.99 40.55,54.67 U4.23 | SPI_CE1.3 56.26,19.43 56.26,45.78 v56.58,46.1
SDA  (via drill 0.35)
  Top 0.152: MCP23008-E/P_0X20.2 50.86,48.96 40.07,48.96 MCP23008-E/P_0X21.2 38.16,47.05 27.37,47.05 MCP23008-E/P_0X23.2 25.3,49.12 v16.89,49.12
  Bottom 0.152: R1.1 2.29,33.88 3.4,34.99 3.4,56.9 6.26,59.75 14.03,59.75 14.03,55.94 15.14,54.83 U4.3 15.3,54.67 15.3,50.7 v16.89,49.12
SHIELD
  Top 0.152: U4.S4 13.4,1.33 60.07,1.33 65.63,6.89 U4.S3 | U4.S1 10.06,58.33 63.41,58.33 65.63,56.1 U4.S2
  Bottom 0.152: U4.S4 7.84,7.05 10.54,9.75 10.54,53.24 7.84,55.94 U4.S1
SOL0
  Top 0.152: U0.16 43.56,11.02 65.63,11.02 VV5Q11-DUP03061.1
SOL1
  Top 0.152: U0.15 44.83,11.33 61.98,11.33 65.79,15.15 67.22,15.15 VV5Q11-DUP03061.3
SOL2  (via drill 0.35)
  Top 0.152: U0.14 46.1,15.15 v48.01,15.15 | v48.96,17.84 49.59,18.48 56.9,18.48 57.06,18.64 64.52,18.64 65.47,17.69 67.22,17.69 VV5Q11-DUP03061.5
  Bottom 0.152: v48.01,15.15 48.96,16.1 v48.96,17.84
SOL3  (via drill 0.35)
  Top 0.152: U0.13 47.37,11.97 v50.55,11.97
  Bottom 0.152: v50.55,11.97 50.86,11.65 50.86,11.02 56.42,5.46 57.69,5.46 57.69,2.45 58.48,1.65 69.12,1.65 69.12,11.49 67.22,13.4 67.22,20.23 VV5Q11-DUP03061.7
SOL4
  Top 0.152: U0.12 48.64,15.3 55.78,15.3 56.9,16.41 64.52,16.41 65.47,17.37 68.33,17.37 69.44,18.48 69.44,23.88 VV5Q11-DUP03061.9
SOL5  (via drill 0.35)
  Top 0.152: U0.11 49.91,14.99 55.94,14.99 57.06,16.1 63.72,16.1 v64.04,15.78
  Bottom 0.152: v64.04,15.78 63.72,16.1 63.72,23.24 65.47,24.99 68.33,24.99 VV5Q11-DUP03061.11
SOL6  (via drill 0.35)
  Top 0.152: U0.10 51.18,12.29 55.78,12.29 57.37,13.88 v63.41,13.88
  Bottom 0.152: v63.41,13.88 63.41,23.4 65.31,25.3 67.22,25.3 67.22,27.84 VV5Q11-DUP03061.13
SOL7
  Top 0.152: U1.16 41.02,28.32 62.61,28.32 64.67,30.38 67.22,30.38 VV5Q11-DUP03061.15
SOL8  (via drill 0.35)
  Top 0.152: U1.15 42.29,28 63.25,28 v64.36,29.12 | v64.67,32.77 64.83,32.92 67.22,32.92 VV5Q11-DUP03061.17
  Bottom 0.152: v64.36,29.12 64.67,29.43 v64.67,32.77
SOL9  (via drill 0.35)
  Top 0.152: U1.14 43.56,27.53 63.41,27.53 63.72,27.84 v66.58,27.84
  Bottom 0.152: v66.58,27.84 67.22,28.48 67.22,35.46 VV5Q11-DUP03061.19
SOL10  (via drill 0.35)
  Top 0.152: U1.13 44.83,26.89 62.77,26.89 63.09,27.21 v64.04,27.21
  Bottom 0.152: v64.04,27.21 63.72,27.53 63.72,35.94 65.79,38 68.33,38 VV5Q11-DUP03061.21
SOL11  (via drill 0.35)
  Top 0.152: U1.12 46.1,26.42 v63.25,26.42
  Bottom 0.152: v63.25,26.42 63.41,26.57 63.41,38.16 65.79,40.55 68.33,40.55 VV5Q11-DUP03061.23
SOL12  (via drill 0.35)
  Top 0.152: U1.11 47.37,23.08 55.47,23.08 57.06,21.49 64.04,21.49 v64.36,21.81
  Bottom 0.152: v64.36,21.81 64.67,21.49 64.67,14.83 VV5Q11-DUP03061.2
SOL13  (via drill 0.35)
  Top 0.152: U1.10 48.64,23.4 56.74,23.4 57.06,23.72 64.52,23.72 65.79,22.45 v66.58,22.45
  Bottom 0.152: v66.58,22.45 66.9,22.13 66.9,17.37 VV5Q11-DUP03061.4
SOL14  (via drill 0.35)
  Top 0.152: v27.05,14.67 27.37,14.67 28.32,13.72 U2.16 | v27.05,16.89 27.37,16.57 v54.99,16.57 | v54.99,19.59 56.58,21.18 65.63,21.18 VV5Q11-DUP03061.8
  Bottom 0.152: v27.05,16.89 v27.05,14.67 | v54.99,19.59 v54.99,16.57
SOL15  (via drill 0.35)
  Top 0.152: U2.15 29.59,14.99 30.54,14.99 v30.86,15.3 | v32.13,29.75 34.2,31.81 64.67,31.81 65.47,32.61 68.64,32.61 69.44,31.81 69.44,24.99 66.9,24.99 VV5Q11-DUP03061.10
  Bottom 0.152: v30.86,15.3 30.54,15.62 30.54,22.13 30.23,22.45 30.23,27.84 v32.13,29.75
SOL16  (via drill 0.35)
  Top 0.152: U2.14 30.86,12.29 29.27,12.29 28.96,12.6 28.96,15.3 24.83,15.3 24.51,14.99 24.51,7.37 36.26,7.37 36.58,7.68 36.58,10.06 40.55,10.06 44.51,6.1 61.34,6.1 62.29,7.05 62.29,10.38 v62.77,10.38
  Bottom 0.152: v62.77,10.38 62.77,23.4 VV5Q11-DUP03061.12
SOL17  (via drill 0.35)
  Top 0.152: v32.13,15.3 U2.13 | v32.77,17.21 51.18,17.21 v51.82,17.84 | v52.61,24.03 53.88,25.3 66.1,25.3 67.22,26.42 67.22,28.96 VV5Q11-DUP03061.14
  Bottom 0.152: v32.13,15.3 32.77,15.94 v32.77,17.21 | v51.82,17.84 52.61,18.64 v52.61,24.03
SOL18  (via drill 0.35)
  Top 0.152: U2.12 33.4,12.29 v36.58,12.29 | v37.21,24.99 40.86,28.64 62.45,28.64 65.31,31.5 VV5Q11-DUP03061.16
  Bottom 0.152: v36.58,12.29 37.21,12.92 v37.21,24.99
SOL19  (via drill 0.35)
  Top 0.152: U2.11 34.67,15.46 32.92,15.46 32.45,15.94 30.23,15.94 v29.91,15.62 | v29.91,30.07 33.88,34.04 VV5Q11-DUP03061.18
  Bottom 0.152: v29.91,30.07 v29.91,15.62
SOL20  (via drill 0.35)
  Top 0.152: U2.10 35.94,15.15 v38.48,15.15 | v40.55,34.67 40.86,34.35 53.72,34.35 55.94,36.58 VV5Q11-DUP03061.20
  Bottom 0.152: v38.48,15.15 40.55,17.21 v40.55,34.67
SOL21  (via drill 0.35)
  Top 0.152: U3.16 25.78,28 v27.05,28 | v27.05,31.34 32.29,36.58 36.42,36.58 38.64,38.8 48.48,38.8 48.64,38.64 51.18,38.64 51.66,39.12 VV5Q11-DUP03061.22
  Bottom 0.152: v27.05,28 27.37,28.32 27.37,31.02 v27.05,31.34
SOL22
  Top 0.152: U3.15 27.05,26.42 33.72,26.42 34.04,26.1 34.04,23.72 34.99,23.72 35.31,24.03 35.31,28.64 24.83,28.64 22.92,30.54 22.92,36.89 36.26,36.89 38.8,39.43 48.17,39.43 50.39,41.66 VV5Q11-DUP03061.24
SOL23  (via drill 0.35)
  Top 0.152: U3.14 28.32,23.4 v42.13,23.4 | v43.24,42.29 44.83,43.88 65.47,43.88 VV5Q11-DUP03061.26
  Bottom 0.152: v42.13,23.4 43.24,24.51 v43.24,42.29

### Text on the board
bPlace: ©2025 LangleyCreations / andrew@langleycreations.com